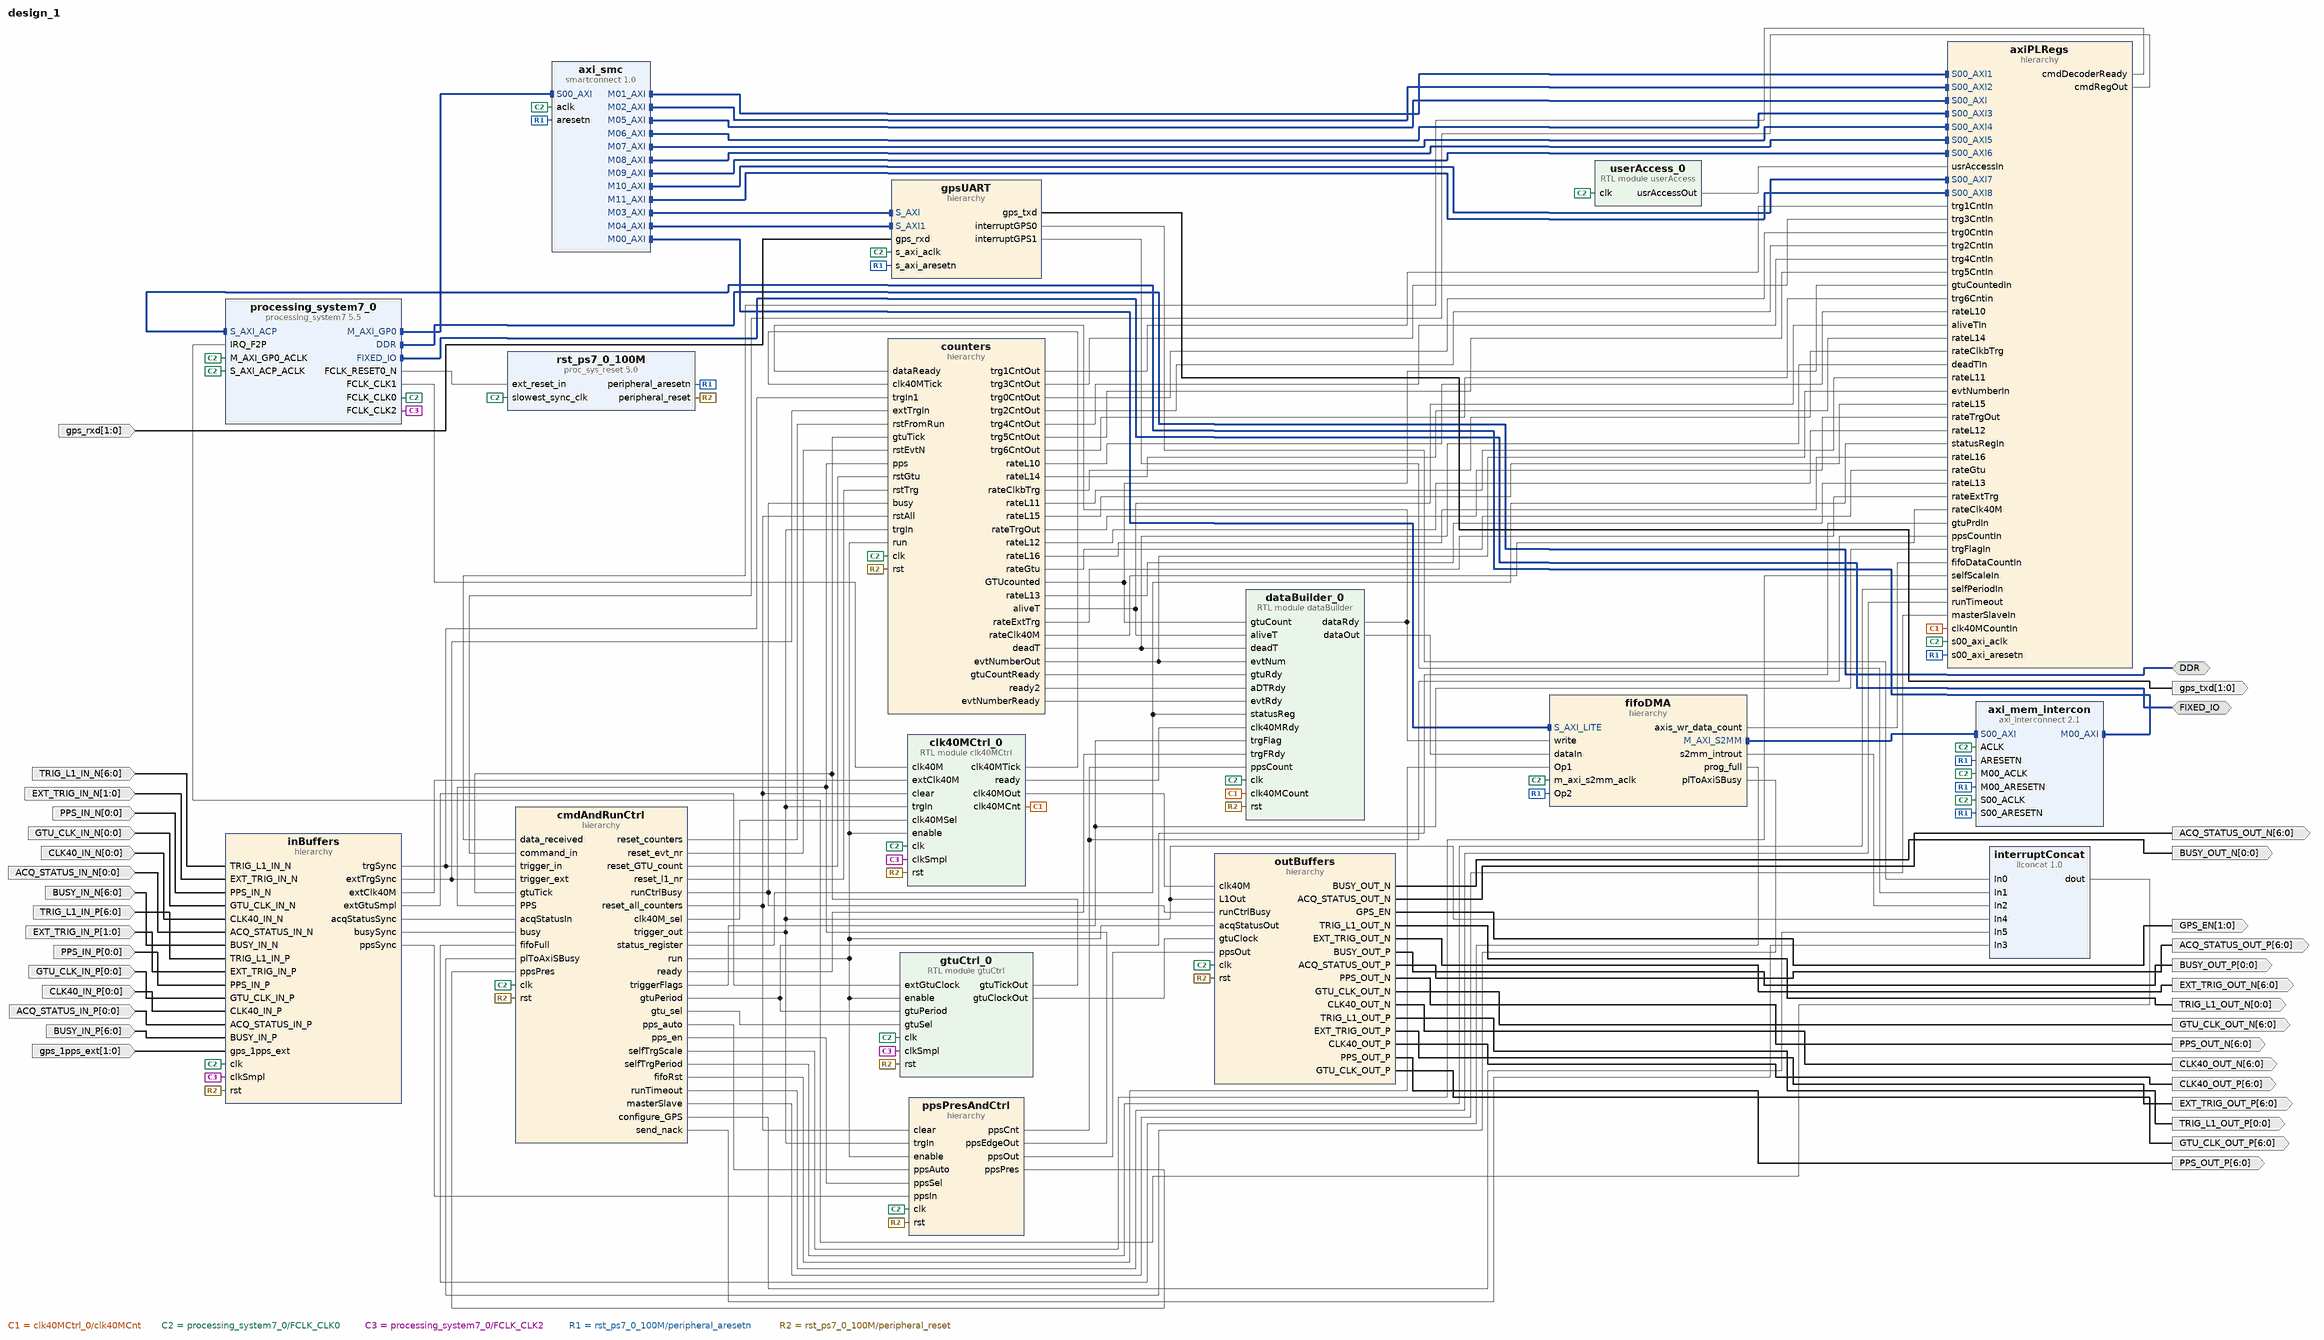
[diagram p0: block diagram of the top level]
# Vivado block design design_1, xc7z020clg484-2, Vivado 2024.2.2
create_bd_design design_1

create_bd_intf_port -mode Master -vlnv xilinx.com:interface:ddrx_rtl:1.0 DDR
create_bd_intf_port -mode Master -vlnv xilinx.com:display_processing_system7:fixedio_rtl:1.0 FIXED_IO
create_bd_port -dir O -from 1 -to 0 GPS_EN
create_bd_port -dir I -from 1 -to 0 gps_1pps_ext
create_bd_port -dir I -from 1 -to 0 gps_rxd
create_bd_port -dir O -from 1 -to 0 gps_txd
create_bd_port -dir I -from 0 -to 0 -type clk PPS_IN_N
create_bd_port -dir I -from 0 -to 0 -type clk PPS_IN_P
create_bd_port -dir O -from 0 -to 0 -type clk BUSY_OUT_N
create_bd_port -dir O -from 0 -to 0 -type clk BUSY_OUT_P
create_bd_port -dir O -from 0 -to 0 -type clk TRIG_L1_OUT_N
create_bd_port -dir O -from 0 -to 0 -type clk TRIG_L1_OUT_P
create_bd_port -dir I -from 1 -to 0 -type clk EXT_TRIG_IN_N
create_bd_port -dir I -from 1 -to 0 -type clk EXT_TRIG_IN_P
create_bd_port -dir I -from 0 -to 0 -type clk GTU_CLK_IN_N
create_bd_port -dir I -from 0 -to 0 -type clk GTU_CLK_IN_P
create_bd_port -dir I -from 0 -to 0 -type clk CLK40_IN_N
create_bd_port -dir I -from 0 -to 0 -type clk CLK40_IN_P
create_bd_port -dir I -from 0 -to 0 -type clk ACQ_STATUS_IN_N
create_bd_port -dir I -from 0 -to 0 -type clk ACQ_STATUS_IN_P
create_bd_port -dir I -from 6 -to 0 -type clk TRIG_L1_IN_N
create_bd_port -dir I -from 6 -to 0 -type clk TRIG_L1_IN_P
create_bd_port -dir I -from 6 -to 0 -type clk BUSY_IN_N
create_bd_port -dir I -from 6 -to 0 -type clk BUSY_IN_P
create_bd_port -dir O -from 6 -to 0 -type clk PPS_OUT_N
create_bd_port -dir O -from 6 -to 0 -type clk PPS_OUT_P
create_bd_port -dir O -from 6 -to 0 -type clk EXT_TRIG_OUT_N
create_bd_port -dir O -from 6 -to 0 -type clk EXT_TRIG_OUT_P
create_bd_port -dir O -from 6 -to 0 -type clk GTU_CLK_OUT_N
create_bd_port -dir O -from 6 -to 0 -type clk GTU_CLK_OUT_P
create_bd_port -dir O -from 6 -to 0 CLK40_OUT_N
create_bd_port -dir O -from 6 -to 0 CLK40_OUT_P
create_bd_port -dir O -from 6 -to 0 -type clk ACQ_STATUS_OUT_N
create_bd_port -dir O -from 6 -to 0 -type clk ACQ_STATUS_OUT_P

create_bd_cell -type ip -vlnv xilinx.com:ip:processing_system7:5.5 processing_system7_0
set_property -dict [list \
  CONFIG.PCW_CAN1_CAN1_IO {MIO 12 .. 13} \
  CONFIG.PCW_CAN1_PERIPHERAL_ENABLE 1 \
  CONFIG.PCW_ENET0_ENET0_IO {MIO 16 .. 27} \
  CONFIG.PCW_ENET0_GRP_MDIO_ENABLE 1 \
  CONFIG.PCW_ENET0_GRP_MDIO_IO {MIO 52 .. 53} \
  CONFIG.PCW_ENET0_PERIPHERAL_ENABLE 1 \
  CONFIG.PCW_ENET_RESET_ENABLE 0 \
  CONFIG.PCW_EN_CLK1_PORT 1 \
  CONFIG.PCW_EN_CLK2_PORT 1 \
  CONFIG.PCW_FCLK_CLK2_BUF TRUE \
  CONFIG.PCW_FPGA0_PERIPHERAL_FREQMHZ 100 \
  CONFIG.PCW_FPGA1_PERIPHERAL_FREQMHZ 40 \
  CONFIG.PCW_FPGA2_PERIPHERAL_FREQMHZ 200 \
  CONFIG.PCW_FPGA_FCLK1_ENABLE 1 \
  CONFIG.PCW_FPGA_FCLK2_ENABLE 1 \
  CONFIG.PCW_GPIO_MIO_GPIO_ENABLE 1 \
  CONFIG.PCW_GPIO_MIO_GPIO_IO MIO \
  CONFIG.PCW_I2C0_GRP_INT_ENABLE 0 \
  CONFIG.PCW_I2C0_I2C0_IO {MIO 10 .. 11} \
  CONFIG.PCW_I2C0_PERIPHERAL_ENABLE 1 \
  CONFIG.PCW_I2C_PERIPHERAL_FREQMHZ 111.111115 \
  CONFIG.PCW_I2C_RESET_ENABLE 0 \
  CONFIG.PCW_IRQ_F2P_INTR 1 \
  CONFIG.PCW_PERIPHERAL_BOARD_PRESET part0 \
  CONFIG.PCW_PRESET_BANK1_VOLTAGE {LVCMOS 1.8V} \
  CONFIG.PCW_QSPI_GRP_FBCLK_ENABLE 1 \
  CONFIG.PCW_QSPI_GRP_FBCLK_IO {MIO 8} \
  CONFIG.PCW_QSPI_GRP_SINGLE_SS_ENABLE 1 \
  CONFIG.PCW_QSPI_GRP_SINGLE_SS_IO {MIO 1 .. 6} \
  CONFIG.PCW_QSPI_PERIPHERAL_ENABLE 1 \
  CONFIG.PCW_QSPI_QSPI_IO {MIO 1 .. 6} \
  CONFIG.PCW_SD0_GRP_CD_ENABLE 0 \
  CONFIG.PCW_SD0_GRP_WP_ENABLE 0 \
  CONFIG.PCW_SD0_PERIPHERAL_ENABLE 1 \
  CONFIG.PCW_SD0_SD0_IO {MIO 40 .. 45} \
  CONFIG.PCW_SD1_PERIPHERAL_ENABLE 1 \
  CONFIG.PCW_SD1_SD1_IO {MIO 46 .. 51} \
  CONFIG.PCW_SDIO_PERIPHERAL_FREQMHZ 100 \
  CONFIG.PCW_SINGLE_QSPI_DATA_MODE x4 \
  CONFIG.PCW_UART0_PERIPHERAL_ENABLE 1 \
  CONFIG.PCW_UART0_UART0_IO {MIO 14 .. 15} \
  CONFIG.PCW_UART1_PERIPHERAL_ENABLE 0 \
  CONFIG.PCW_UART_PERIPHERAL_FREQMHZ 100 \
  CONFIG.PCW_UIPARAM_DDR_PARTNO {MT41J256M16 RE-125} \
  CONFIG.PCW_USB0_PERIPHERAL_ENABLE 0 \
  CONFIG.PCW_USB_RESET_ENABLE 0 \
  CONFIG.PCW_USE_FABRIC_INTERRUPT 1 \
  CONFIG.PCW_USE_S_AXI_ACP 1 \
] [get_bd_cells processing_system7_0]
# 238 more settings of processing_system7_0 are not shown: defaults, MIO pin electricals, DDR timing, and values the tool derives
create_bd_cell -type ip -vlnv xilinx.com:ip:proc_sys_reset:5.0 rst_ps7_0_100M
create_bd_cell -type inline_hdl -vlnv xilinx.com:inline_hdl:ilconcat:1.0 interruptConcat
set_property -dict {CONFIG.NUM_PORTS 6} [get_bd_cells interruptConcat]
create_bd_cell -type module -reference dataBuilder dataBuilder_0
set_property -dict {CONFIG.dataWords 9 CONFIG.statusLen 64 CONFIG.trgNum 9} [get_bd_cells dataBuilder_0]
create_bd_cell -type ip -vlnv xilinx.com:ip:axi_interconnect:2.1 axi_mem_intercon
set_property -dict {CONFIG.NUM_MI 1} [get_bd_cells axi_mem_intercon]
create_bd_cell -type hier cmdAndRunCtrl
create_bd_cell -type hier counters
create_bd_cell -type hier outBuffers
create_bd_cell -type hier fifoDMA
create_bd_cell -type hier gpsUART
create_bd_cell -type hier ppsPresAndCtrl
create_bd_cell -type hier axiPLRegs
create_bd_cell -type hier inBuffers
create_bd_cell -type ip -vlnv xilinx.com:ip:smartconnect:1.0 axi_smc
set_property -dict {CONFIG.NUM_MI 12 CONFIG.NUM_SI 1} [get_bd_cells axi_smc]
create_bd_cell -type module -reference gtuCtrl gtuCtrl_0
create_bd_cell -type module -reference userAccess userAccess_0
create_bd_cell -type module -reference clk40MCtrl clk40MCtrl_0
set_property -dict {CONFIG.trgDelay 3} [get_bd_cells clk40MCtrl_0]

# ---- hierarchy /cmdAndRunCtrl ----
current_bd_instance /cmdAndRunCtrl
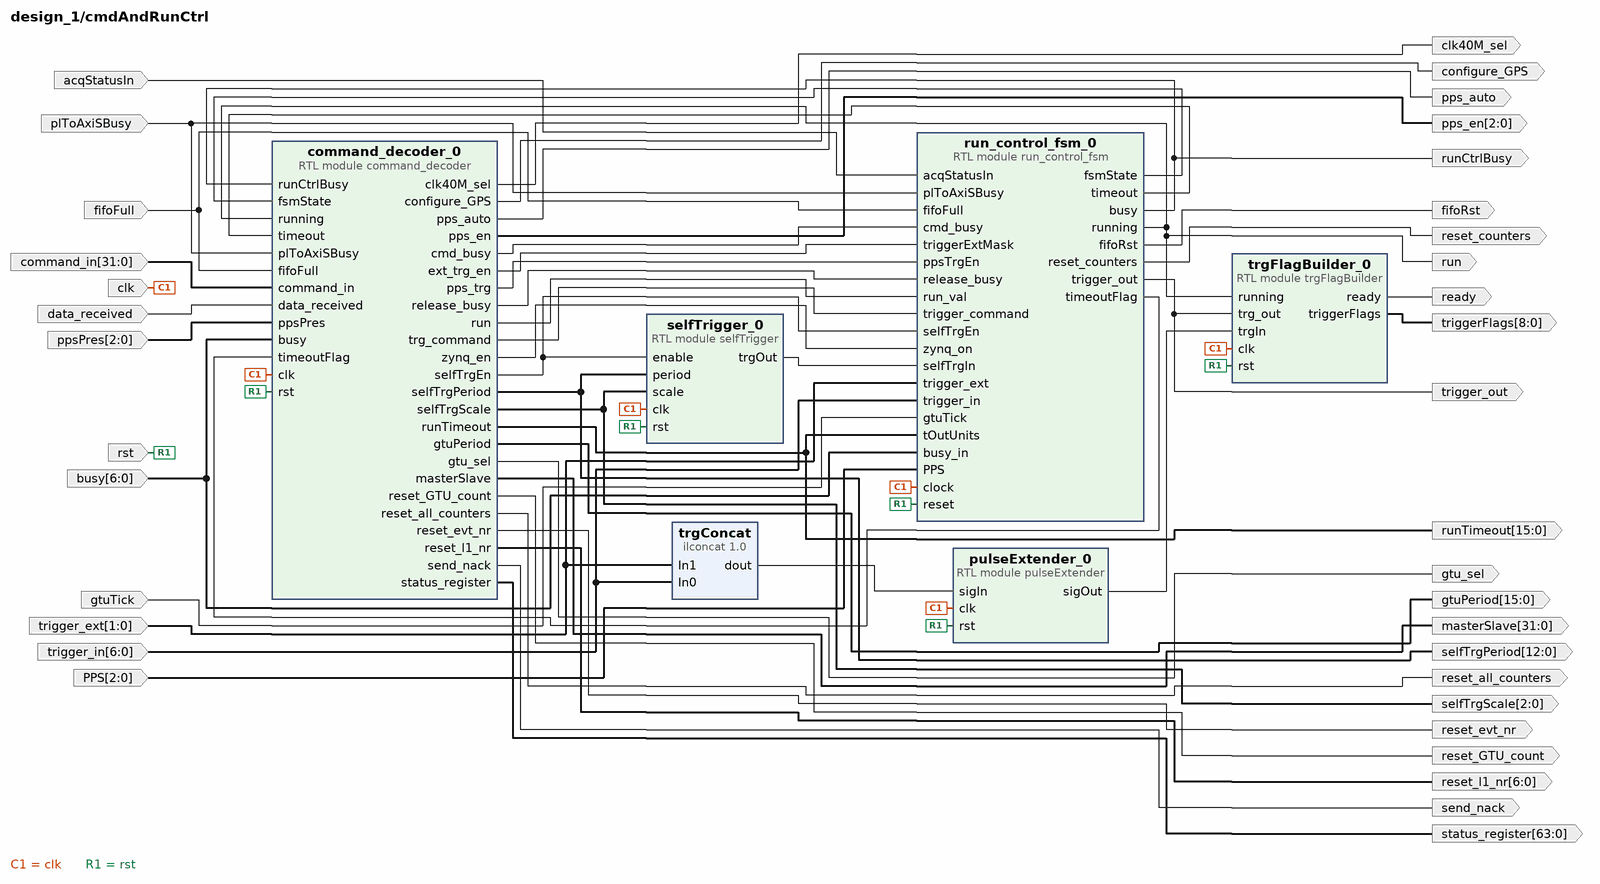
[diagram p1: block diagram inside /cmdAndRunCtrl]
create_bd_pin -dir I -type rst rst
create_bd_pin -dir I -type clk clk
create_bd_pin -dir I gtuTick
create_bd_pin -dir I -from 6 -to 0 trigger_in
create_bd_pin -dir I -from 6 -to 0 busy
create_bd_pin -dir I -from 1 -to 0 trigger_ext
create_bd_pin -dir I -from 2 -to 0 PPS
create_bd_pin -dir I plToAxiSBusy
create_bd_pin -dir I fifoFull
create_bd_pin -dir O trigger_out
create_bd_pin -dir O runCtrlBusy
create_bd_pin -dir O -type rst reset_counters
create_bd_pin -dir O ready
create_bd_pin -dir O -from 8 -to 0 triggerFlags
create_bd_pin -dir O send_nack
create_bd_pin -dir O run
create_bd_pin -dir O -type rst reset_evt_nr
create_bd_pin -dir O -type rst reset_GTU_count
create_bd_pin -dir O -type rst reset_all_counters
create_bd_pin -dir O -from 63 -to 0 status_register
create_bd_pin -dir O -from 2 -to 0 pps_en
create_bd_pin -dir I data_received
create_bd_pin -dir I -from 2 -to 0 ppsPres
create_bd_pin -dir O pps_auto
create_bd_pin -dir I -from 31 -to 0 command_in
create_bd_pin -dir O configure_GPS
create_bd_pin -dir O gtu_sel
create_bd_pin -dir O fifoRst
create_bd_pin -dir O clk40M_sel
create_bd_pin -dir I acqStatusIn
create_bd_pin -dir O -from 6 -to 0 reset_l1_nr
create_bd_pin -dir O -from 15 -to 0 gtuPeriod
create_bd_pin -dir O -from 31 -to 0 masterSlave
create_bd_pin -dir O -from 2 -to 0 selfTrgScale
create_bd_pin -dir O -from 12 -to 0 selfTrgPeriod
create_bd_pin -dir O -from 15 -to 0 runTimeout

create_bd_cell -type module -reference run_control_fsm run_control_fsm_0
set_property -dict [list \
  CONFIG.N_gtu 64 \
  CONFIG.extTrgNum 2 \
  CONFIG.gpsNum 2 \
  CONFIG.nClkRst 32 \
  CONFIG.nClkTick 100000000 \
  CONFIG.zynqNum 7 \
] [get_bd_cells run_control_fsm_0]
create_bd_cell -type module -reference trgFlagBuilder trgFlagBuilder_0
set_property -dict {CONFIG.trgNum 9} [get_bd_cells trgFlagBuilder_0]
create_bd_cell -type module -reference command_decoder command_decoder_0
set_property -dict {CONFIG.extTrgNum 2 CONFIG.ppsNum 3 CONFIG.statusLen 64 CONFIG.zynqNum 7} [get_bd_cells command_decoder_0]
create_bd_cell -type module -reference pulseExtender pulseExtender_0
set_property -dict {CONFIG.sigNum 9 CONFIG.sigWidth 10} [get_bd_cells pulseExtender_0]
create_bd_cell -type inline_hdl -vlnv xilinx.com:inline_hdl:ilconcat:1.0 trgConcat
set_property -dict {CONFIG.NUM_PORTS 2} [get_bd_cells trgConcat]
create_bd_cell -type module -reference selfTrigger selfTrigger_0

# ---- hierarchy /counters ----
current_bd_instance /counters
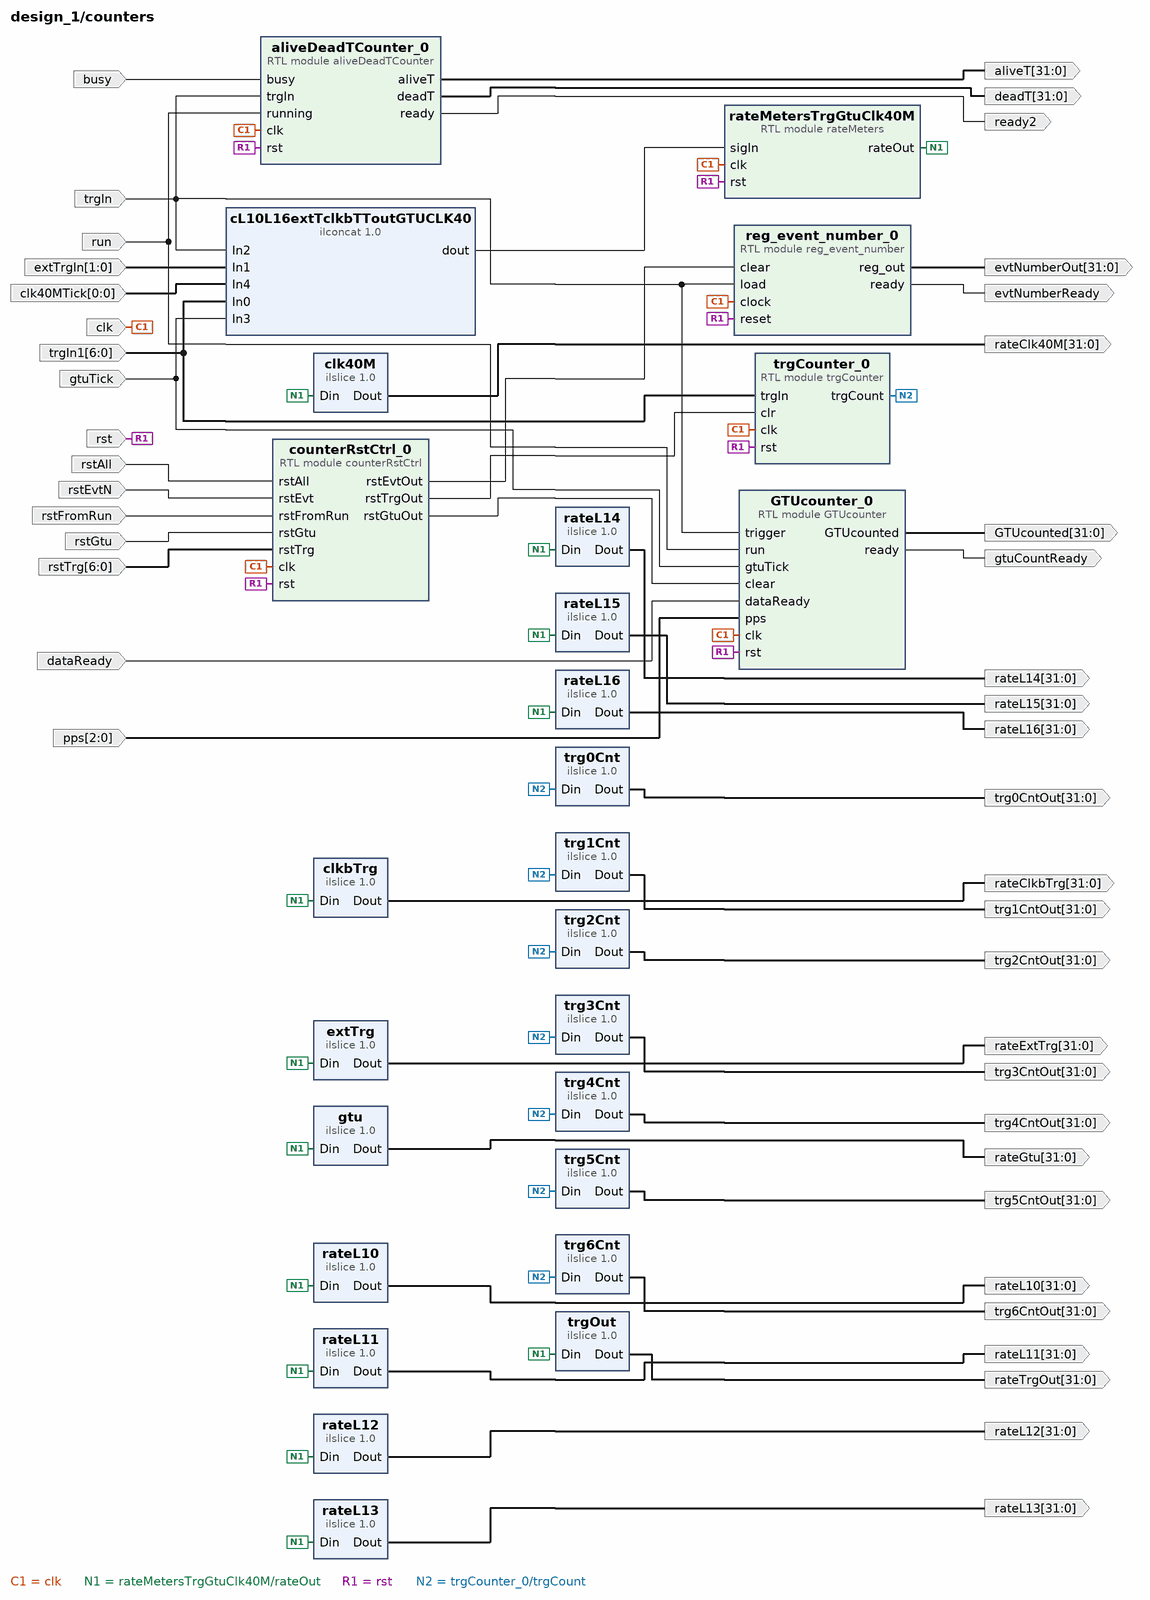
[diagram p2: block diagram inside /counters]
create_bd_pin -dir I -type clk clk
create_bd_pin -dir I -type rst rst
create_bd_pin -dir I trgIn
create_bd_pin -dir O evtNumberReady
create_bd_pin -dir O -from 31 -to 0 evtNumberOut
create_bd_pin -dir I run
create_bd_pin -dir I -from 2 -to 0 pps
create_bd_pin -dir I gtuTick
create_bd_pin -dir O gtuCountReady
create_bd_pin -dir O -from 31 -to 0 GTUcounted
create_bd_pin -dir I busy
create_bd_pin -dir O ready2
create_bd_pin -dir O -from 31 -to 0 aliveT
create_bd_pin -dir O -from 31 -to 0 deadT
create_bd_pin -dir I -from 6 -to 0 trgIn1
create_bd_pin -dir I rstEvtN
create_bd_pin -dir I rstFromRun
create_bd_pin -dir I rstGtu
create_bd_pin -dir I rstAll
create_bd_pin -dir O -from 31 -to 0 trg1CntOut
create_bd_pin -dir O -from 31 -to 0 trg3CntOut
create_bd_pin -dir O -from 31 -to 0 trg0CntOut
create_bd_pin -dir O -from 31 -to 0 trg2CntOut
create_bd_pin -dir I dataReady
create_bd_pin -dir O -from 31 -to 0 trg4CntOut
create_bd_pin -dir O -from 31 -to 0 trg5CntOut
create_bd_pin -dir O -from 31 -to 0 trg6CntOut
create_bd_pin -dir I -from 6 -to 0 rstTrg
create_bd_pin -dir I -from 1 -to 0 extTrgIn
create_bd_pin -dir I -from 0 -to 0 clk40MTick
create_bd_pin -dir O -from 31 -to 0 rateL10
create_bd_pin -dir O -from 31 -to 0 rateL11
create_bd_pin -dir O -from 31 -to 0 rateL12
create_bd_pin -dir O -from 31 -to 0 rateL13
create_bd_pin -dir O -from 31 -to 0 rateL14
create_bd_pin -dir O -from 31 -to 0 rateL15
create_bd_pin -dir O -from 31 -to 0 rateL16
create_bd_pin -dir O -from 31 -to 0 rateExtTrg
create_bd_pin -dir O -from 31 -to 0 rateClkbTrg
create_bd_pin -dir O -from 31 -to 0 rateTrgOut
create_bd_pin -dir O -from 31 -to 0 rateGtu
create_bd_pin -dir O -from 31 -to 0 rateClk40M

create_bd_cell -type module -reference reg_event_number reg_event_number_0
create_bd_cell -type module -reference GTUcounter GTUcounter_0
create_bd_cell -type module -reference aliveDeadTCounter aliveDeadTCounter_0
create_bd_cell -type module -reference trgCounter trgCounter_0
set_property -dict {CONFIG.trgNum 7} [get_bd_cells trgCounter_0]
create_bd_cell -type module -reference counterRstCtrl counterRstCtrl_0
set_property -dict {CONFIG.zynqNum 7} [get_bd_cells counterRstCtrl_0]
create_bd_cell -type inline_hdl -vlnv xilinx.com:inline_hdl:ilslice:1.0 trg1Cnt
set_property -dict {CONFIG.DIN_FROM 63 CONFIG.DIN_TO 32 CONFIG.DIN_WIDTH 224} [get_bd_cells trg1Cnt]
create_bd_cell -type inline_hdl -vlnv xilinx.com:inline_hdl:ilslice:1.0 trg2Cnt
set_property -dict {CONFIG.DIN_FROM 95 CONFIG.DIN_TO 64 CONFIG.DIN_WIDTH 224} [get_bd_cells trg2Cnt]
create_bd_cell -type inline_hdl -vlnv xilinx.com:inline_hdl:ilslice:1.0 trg0Cnt
set_property -dict {CONFIG.DIN_FROM 31 CONFIG.DIN_WIDTH 224} [get_bd_cells trg0Cnt]
create_bd_cell -type inline_hdl -vlnv xilinx.com:inline_hdl:ilslice:1.0 trg3Cnt
set_property -dict {CONFIG.DIN_FROM 127 CONFIG.DIN_TO 96 CONFIG.DIN_WIDTH 224} [get_bd_cells trg3Cnt]
create_bd_cell -type inline_hdl -vlnv xilinx.com:inline_hdl:ilslice:1.0 trg4Cnt
set_property -dict {CONFIG.DIN_FROM 159 CONFIG.DIN_TO 128 CONFIG.DIN_WIDTH 224} [get_bd_cells trg4Cnt]
create_bd_cell -type inline_hdl -vlnv xilinx.com:inline_hdl:ilslice:1.0 trg5Cnt
set_property -dict {CONFIG.DIN_FROM 191 CONFIG.DIN_TO 160 CONFIG.DIN_WIDTH 224} [get_bd_cells trg5Cnt]
create_bd_cell -type inline_hdl -vlnv xilinx.com:inline_hdl:ilslice:1.0 trg6Cnt
set_property -dict {CONFIG.DIN_FROM 223 CONFIG.DIN_TO 192 CONFIG.DIN_WIDTH 224} [get_bd_cells trg6Cnt]
create_bd_cell -type module -reference rateMeters rateMetersTrgGtuClk40M
set_property -dict {CONFIG.clkFreq 100000000 CONFIG.rateLen 32 CONFIG.sigNum 12} [get_bd_cells rateMetersTrgGtuClk40M]
create_bd_cell -type inline_hdl -vlnv xilinx.com:inline_hdl:ilconcat:1.0 cL10L16extTclkbTToutGTUCLK40
set_property -dict {CONFIG.NUM_PORTS 5} [get_bd_cells cL10L16extTclkbTToutGTUCLK40]
create_bd_cell -type inline_hdl -vlnv xilinx.com:inline_hdl:ilslice:1.0 rateL10
set_property -dict {CONFIG.DIN_FROM 31 CONFIG.DIN_WIDTH 384} [get_bd_cells rateL10]
create_bd_cell -type inline_hdl -vlnv xilinx.com:inline_hdl:ilslice:1.0 rateL13
set_property -dict {CONFIG.DIN_FROM 127 CONFIG.DIN_TO 96 CONFIG.DIN_WIDTH 384} [get_bd_cells rateL13]
create_bd_cell -type inline_hdl -vlnv xilinx.com:inline_hdl:ilslice:1.0 rateL14
set_property -dict {CONFIG.DIN_FROM 159 CONFIG.DIN_TO 128 CONFIG.DIN_WIDTH 384} [get_bd_cells rateL14]
create_bd_cell -type inline_hdl -vlnv xilinx.com:inline_hdl:ilslice:1.0 rateL15
set_property -dict {CONFIG.DIN_FROM 191 CONFIG.DIN_TO 160 CONFIG.DIN_WIDTH 384} [get_bd_cells rateL15]
create_bd_cell -type inline_hdl -vlnv xilinx.com:inline_hdl:ilslice:1.0 rateL16
set_property -dict {CONFIG.DIN_FROM 223 CONFIG.DIN_TO 192 CONFIG.DIN_WIDTH 384} [get_bd_cells rateL16]
create_bd_cell -type inline_hdl -vlnv xilinx.com:inline_hdl:ilslice:1.0 clkbTrg
set_property -dict {CONFIG.DIN_FROM 255 CONFIG.DIN_TO 224 CONFIG.DIN_WIDTH 384} [get_bd_cells clkbTrg]
create_bd_cell -type inline_hdl -vlnv xilinx.com:inline_hdl:ilslice:1.0 extTrg
set_property -dict {CONFIG.DIN_FROM 287 CONFIG.DIN_TO 256 CONFIG.DIN_WIDTH 384} [get_bd_cells extTrg]
create_bd_cell -type inline_hdl -vlnv xilinx.com:inline_hdl:ilslice:1.0 trgOut
set_property -dict {CONFIG.DIN_FROM 319 CONFIG.DIN_TO 288 CONFIG.DIN_WIDTH 384} [get_bd_cells trgOut]
create_bd_cell -type inline_hdl -vlnv xilinx.com:inline_hdl:ilslice:1.0 gtu
set_property -dict {CONFIG.DIN_FROM 351 CONFIG.DIN_TO 320 CONFIG.DIN_WIDTH 384 CONFIG.DOUT_WIDTH 32} [get_bd_cells gtu]
create_bd_cell -type inline_hdl -vlnv xilinx.com:inline_hdl:ilslice:1.0 clk40M
set_property -dict {CONFIG.DIN_FROM 383 CONFIG.DIN_TO 352 CONFIG.DIN_WIDTH 384} [get_bd_cells clk40M]
create_bd_cell -type inline_hdl -vlnv xilinx.com:inline_hdl:ilslice:1.0 rateL12
set_property -dict {CONFIG.DIN_FROM 95 CONFIG.DIN_TO 64 CONFIG.DIN_WIDTH 384} [get_bd_cells rateL12]
create_bd_cell -type inline_hdl -vlnv xilinx.com:inline_hdl:ilslice:1.0 rateL11
set_property -dict {CONFIG.DIN_FROM 63 CONFIG.DIN_TO 32 CONFIG.DIN_WIDTH 384} [get_bd_cells rateL11]

# ---- hierarchy /outBuffers ----
current_bd_instance /outBuffers
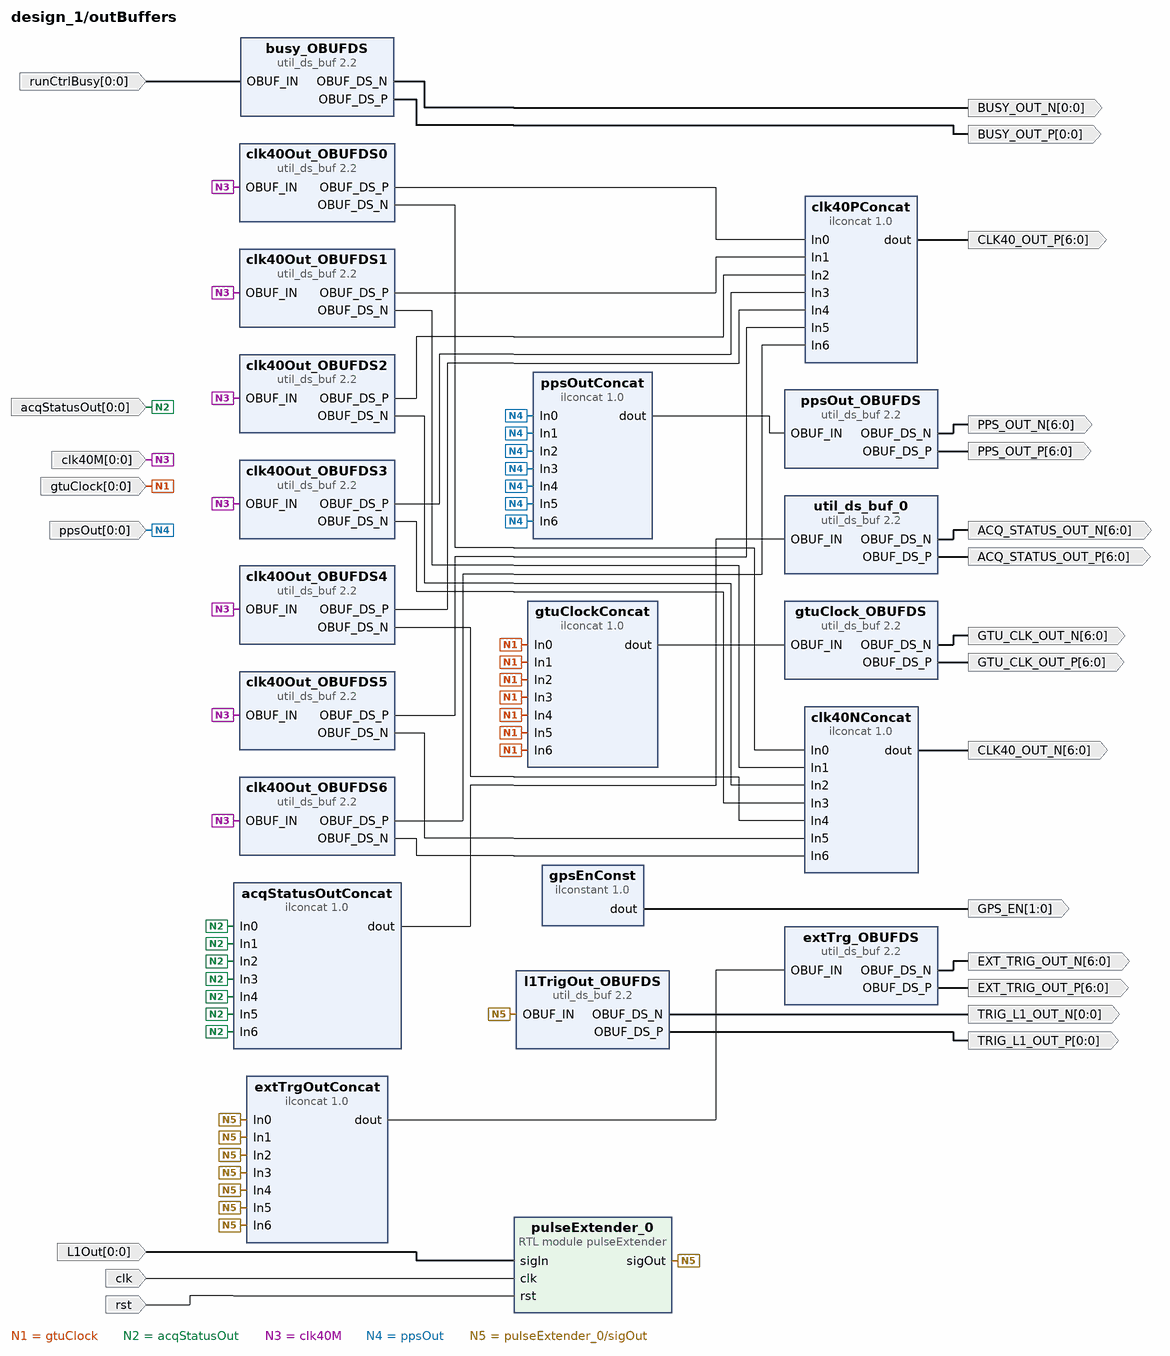
[diagram p3: block diagram inside /outBuffers]
create_bd_pin -dir I -from 0 -to 0 gtuClock
create_bd_pin -dir I -from 0 -to 0 L1Out
create_bd_pin -dir O -from 1 -to 0 GPS_EN
create_bd_pin -dir I -from 0 -to 0 ppsOut
create_bd_pin -dir I -type clk clk
create_bd_pin -dir I -type rst rst
create_bd_pin -dir I -from 0 -to 0 -type clk runCtrlBusy
create_bd_pin -dir O -from 0 -to 0 -type clk BUSY_OUT_N
create_bd_pin -dir O -from 0 -to 0 -type clk BUSY_OUT_P
create_bd_pin -dir O -from 0 -to 0 -type clk TRIG_L1_OUT_N
create_bd_pin -dir O -from 0 -to 0 -type clk TRIG_L1_OUT_P
create_bd_pin -dir I -from 0 -to 0 -type clk clk40M
create_bd_pin -dir I -from 0 -to 0 -type clk acqStatusOut
create_bd_pin -dir O -from 6 -to 0 -type clk PPS_OUT_N
create_bd_pin -dir O -from 6 -to 0 -type clk PPS_OUT_P
create_bd_pin -dir O -from 6 -to 0 -type clk EXT_TRIG_OUT_N
create_bd_pin -dir O -from 6 -to 0 -type clk EXT_TRIG_OUT_P
create_bd_pin -dir O -from 6 -to 0 -type clk GTU_CLK_OUT_N
create_bd_pin -dir O -from 6 -to 0 -type clk GTU_CLK_OUT_P
create_bd_pin -dir O -from 6 -to 0 CLK40_OUT_N
create_bd_pin -dir O -from 6 -to 0 CLK40_OUT_P
create_bd_pin -dir O -from 6 -to 0 -type clk ACQ_STATUS_OUT_N
create_bd_pin -dir O -from 6 -to 0 -type clk ACQ_STATUS_OUT_P

create_bd_cell -type inline_hdl -vlnv xilinx.com:inline_hdl:ilconcat:1.0 gtuClockConcat
set_property -dict {CONFIG.NUM_PORTS 7} [get_bd_cells gtuClockConcat]
create_bd_cell -type ip -vlnv xilinx.com:ip:util_ds_buf:2.2 ppsOut_OBUFDS
set_property -dict {CONFIG.C_BUF_TYPE OBUFDS CONFIG.C_SIZE 7} [get_bd_cells ppsOut_OBUFDS]
create_bd_cell -type ip -vlnv xilinx.com:ip:util_ds_buf:2.2 gtuClock_OBUFDS
set_property -dict {CONFIG.C_BUF_TYPE OBUFDS CONFIG.C_SIZE 7} [get_bd_cells gtuClock_OBUFDS]
create_bd_cell -type inline_hdl -vlnv xilinx.com:inline_hdl:ilconcat:1.0 extTrgOutConcat
set_property -dict {CONFIG.NUM_PORTS 7} [get_bd_cells extTrgOutConcat]
create_bd_cell -type ip -vlnv xilinx.com:ip:util_ds_buf:2.2 clk40Out_OBUFDS0
set_property -dict {CONFIG.C_BUF_TYPE OBUFDS CONFIG.C_SIZE 1} [get_bd_cells clk40Out_OBUFDS0]
create_bd_cell -type ip -vlnv xilinx.com:ip:util_ds_buf:2.2 extTrg_OBUFDS
set_property -dict {CONFIG.C_BUF_TYPE OBUFDS CONFIG.C_SIZE 7} [get_bd_cells extTrg_OBUFDS]
create_bd_cell -type inline_hdl -vlnv xilinx.com:inline_hdl:ilconstant:1.0 gpsEnConst
set_property -dict {CONFIG.CONST_VAL 0b11 CONFIG.CONST_WIDTH 2} [get_bd_cells gpsEnConst]
create_bd_cell -type inline_hdl -vlnv xilinx.com:inline_hdl:ilconcat:1.0 ppsOutConcat
set_property -dict {CONFIG.NUM_PORTS 7} [get_bd_cells ppsOutConcat]
create_bd_cell -type module -reference pulseExtender pulseExtender_0
set_property -dict {CONFIG.sigNum 1 CONFIG.sigWidth 10} [get_bd_cells pulseExtender_0]
create_bd_cell -type ip -vlnv xilinx.com:ip:util_ds_buf:2.2 busy_OBUFDS
set_property -dict {CONFIG.C_BUF_TYPE OBUFDS} [get_bd_cells busy_OBUFDS]
create_bd_cell -type ip -vlnv xilinx.com:ip:util_ds_buf:2.2 l1TrigOut_OBUFDS
set_property -dict {CONFIG.C_BUF_TYPE OBUFDS} [get_bd_cells l1TrigOut_OBUFDS]
create_bd_cell -type ip -vlnv xilinx.com:ip:util_ds_buf:2.2 clk40Out_OBUFDS1
set_property -dict {CONFIG.C_BUF_TYPE OBUFDS} [get_bd_cells clk40Out_OBUFDS1]
create_bd_cell -type ip -vlnv xilinx.com:ip:util_ds_buf:2.2 clk40Out_OBUFDS2
set_property -dict {CONFIG.C_BUF_TYPE OBUFDS} [get_bd_cells clk40Out_OBUFDS2]
create_bd_cell -type ip -vlnv xilinx.com:ip:util_ds_buf:2.2 clk40Out_OBUFDS3
set_property -dict {CONFIG.C_BUF_TYPE OBUFDS} [get_bd_cells clk40Out_OBUFDS3]
create_bd_cell -type inline_hdl -vlnv xilinx.com:inline_hdl:ilconcat:1.0 clk40NConcat
set_property -dict {CONFIG.NUM_PORTS 7} [get_bd_cells clk40NConcat]
create_bd_cell -type inline_hdl -vlnv xilinx.com:inline_hdl:ilconcat:1.0 clk40PConcat
set_property -dict {CONFIG.NUM_PORTS 7} [get_bd_cells clk40PConcat]
create_bd_cell -type ip -vlnv xilinx.com:ip:util_ds_buf:2.2 util_ds_buf_0
set_property -dict {CONFIG.C_BUF_TYPE OBUFDS CONFIG.C_SIZE 7} [get_bd_cells util_ds_buf_0]
create_bd_cell -type inline_hdl -vlnv xilinx.com:inline_hdl:ilconcat:1.0 acqStatusOutConcat
set_property -dict {CONFIG.NUM_PORTS 7} [get_bd_cells acqStatusOutConcat]
create_bd_cell -type ip -vlnv xilinx.com:ip:util_ds_buf:2.2 clk40Out_OBUFDS4
set_property -dict {CONFIG.C_BUF_TYPE OBUFDS} [get_bd_cells clk40Out_OBUFDS4]
create_bd_cell -type ip -vlnv xilinx.com:ip:util_ds_buf:2.2 clk40Out_OBUFDS5
set_property -dict {CONFIG.C_BUF_TYPE OBUFDS} [get_bd_cells clk40Out_OBUFDS5]
create_bd_cell -type ip -vlnv xilinx.com:ip:util_ds_buf:2.2 clk40Out_OBUFDS6
set_property -dict {CONFIG.C_BUF_TYPE OBUFDS} [get_bd_cells clk40Out_OBUFDS6]

# ---- hierarchy /fifoDMA ----
current_bd_instance /fifoDMA
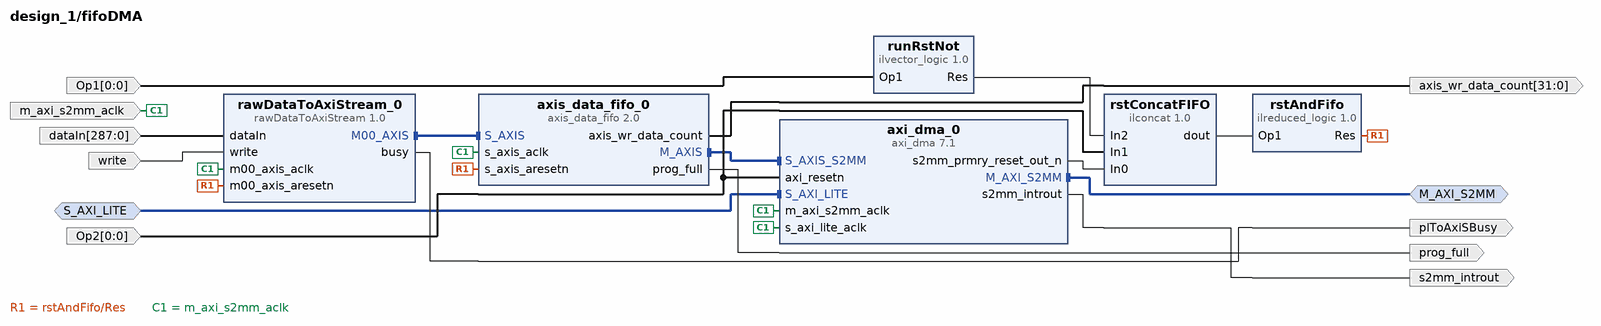
[diagram p4: block diagram inside /fifoDMA]
create_bd_intf_pin -mode Slave -vlnv xilinx.com:interface:aximm_rtl:1.0 S_AXI_LITE
create_bd_intf_pin -mode Master -vlnv xilinx.com:interface:aximm_rtl:1.0 M_AXI_S2MM
create_bd_pin -dir I -type clk m_axi_s2mm_aclk
create_bd_pin -dir I -from 0 -to 0 Op2
create_bd_pin -dir O -type intr s2mm_introut
create_bd_pin -dir O prog_full
create_bd_pin -dir O -from 31 -to 0 axis_wr_data_count
create_bd_pin -dir O plToAxiSBusy
create_bd_pin -dir I -from 287 -to 0 dataIn
create_bd_pin -dir I write
create_bd_pin -dir I -from 0 -to 0 Op1

create_bd_cell -type ip -vlnv xilinx.com:ip:axi_dma:7.1 axi_dma_0
set_property -dict {CONFIG.c_include_mm2s 0 CONFIG.c_include_sg 0} [get_bd_cells axi_dma_0]
create_bd_cell -type ip -vlnv xilinx.com:ip:axis_data_fifo:2.0 axis_data_fifo_0
set_property -dict [list \
  CONFIG.FIFO_DEPTH 4096 \
  CONFIG.FIFO_MEMORY_TYPE block \
  CONFIG.FIFO_MODE 2 \
  CONFIG.HAS_PROG_FULL 1 \
  CONFIG.HAS_WR_DATA_COUNT 1 \
  CONFIG.PROG_FULL_THRESH 2043 \
] [get_bd_cells axis_data_fifo_0]
create_bd_cell -type ip -vlnv mames:user:rawDataToAxiStream:1.0 rawDataToAxiStream_0
set_property -dict {CONFIG.C_M00_AXIS_START_COUNT 1 CONFIG.rawDataSize 288} [get_bd_cells rawDataToAxiStream_0]
create_bd_cell -type inline_hdl -vlnv xilinx.com:inline_hdl:ilreduced_logic:1.0 rstAndFifo
set_property -dict {CONFIG.C_SIZE 3} [get_bd_cells rstAndFifo]
create_bd_cell -type inline_hdl -vlnv xilinx.com:inline_hdl:ilconcat:1.0 rstConcatFIFO
set_property -dict {CONFIG.NUM_PORTS 3} [get_bd_cells rstConcatFIFO]
create_bd_cell -type inline_hdl -vlnv xilinx.com:inline_hdl:ilvector_logic:1.0 runRstNot
set_property -dict {CONFIG.C_OPERATION not CONFIG.C_SIZE 1} [get_bd_cells runRstNot]

# ---- hierarchy /gpsUART ----
current_bd_instance /gpsUART
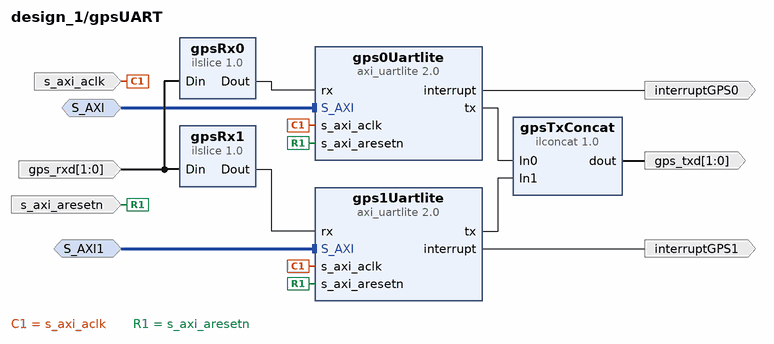
[diagram p5: block diagram inside /gpsUART]
create_bd_intf_pin -mode Slave -vlnv xilinx.com:interface:aximm_rtl:1.0 S_AXI
create_bd_intf_pin -mode Slave -vlnv xilinx.com:interface:aximm_rtl:1.0 S_AXI1
create_bd_pin -dir I -type clk s_axi_aclk
create_bd_pin -dir I -type rst s_axi_aresetn
create_bd_pin -dir O -type intr interruptGPS1
create_bd_pin -dir O -type intr interruptGPS0
create_bd_pin -dir I -from 1 -to 0 gps_rxd
create_bd_pin -dir O -from 1 -to 0 gps_txd

create_bd_cell -type ip -vlnv xilinx.com:ip:axi_uartlite:2.0 gps1Uartlite
set_property -dict {CONFIG.C_BAUDRATE 115200} [get_bd_cells gps1Uartlite]
create_bd_cell -type ip -vlnv xilinx.com:ip:axi_uartlite:2.0 gps0Uartlite
set_property -dict {CONFIG.C_BAUDRATE 115200} [get_bd_cells gps0Uartlite]
create_bd_cell -type inline_hdl -vlnv xilinx.com:inline_hdl:ilslice:1.0 gpsRx1
set_property -dict {CONFIG.DIN_FROM 1 CONFIG.DIN_TO 1 CONFIG.DIN_WIDTH 2} [get_bd_cells gpsRx1]
create_bd_cell -type inline_hdl -vlnv xilinx.com:inline_hdl:ilslice:1.0 gpsRx0
set_property -dict {CONFIG.DIN_WIDTH 2} [get_bd_cells gpsRx0]
create_bd_cell -type inline_hdl -vlnv xilinx.com:inline_hdl:ilconcat:1.0 gpsTxConcat

# ---- hierarchy /ppsPresAndCtrl ----
current_bd_instance /ppsPresAndCtrl
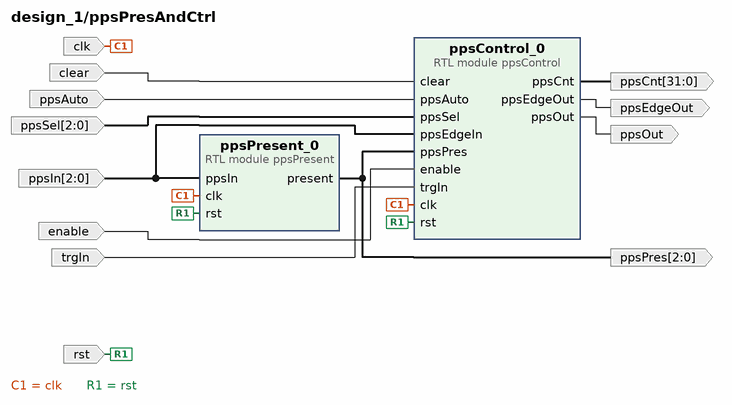
[diagram p6: block diagram inside /ppsPresAndCtrl]
create_bd_pin -dir I -type clk clk
create_bd_pin -dir I -type rst rst
create_bd_pin -dir I -from 2 -to 0 ppsIn
create_bd_pin -dir O -from 2 -to 0 ppsPres
create_bd_pin -dir I ppsAuto
create_bd_pin -dir I -from 2 -to 0 ppsSel
create_bd_pin -dir O ppsOut
create_bd_pin -dir I clear
create_bd_pin -dir O -from 31 -to 0 ppsCnt
create_bd_pin -dir O ppsEdgeOut
create_bd_pin -dir I enable
create_bd_pin -dir I trgIn

create_bd_cell -type module -reference ppsPresent ppsPresent_0
set_property -dict {CONFIG.ppsNum 3 CONFIG.ppsRstVal 1 CONFIG.presWindow 150000000} [get_bd_cells ppsPresent_0]
create_bd_cell -type module -reference ppsControl ppsControl_0
set_property -dict {CONFIG.clkFreq 100000000 CONFIG.ppsNum 3 CONFIG.ppsWidth 10} [get_bd_cells ppsControl_0]

# ---- hierarchy /axiPLRegs ----
current_bd_instance /axiPLRegs
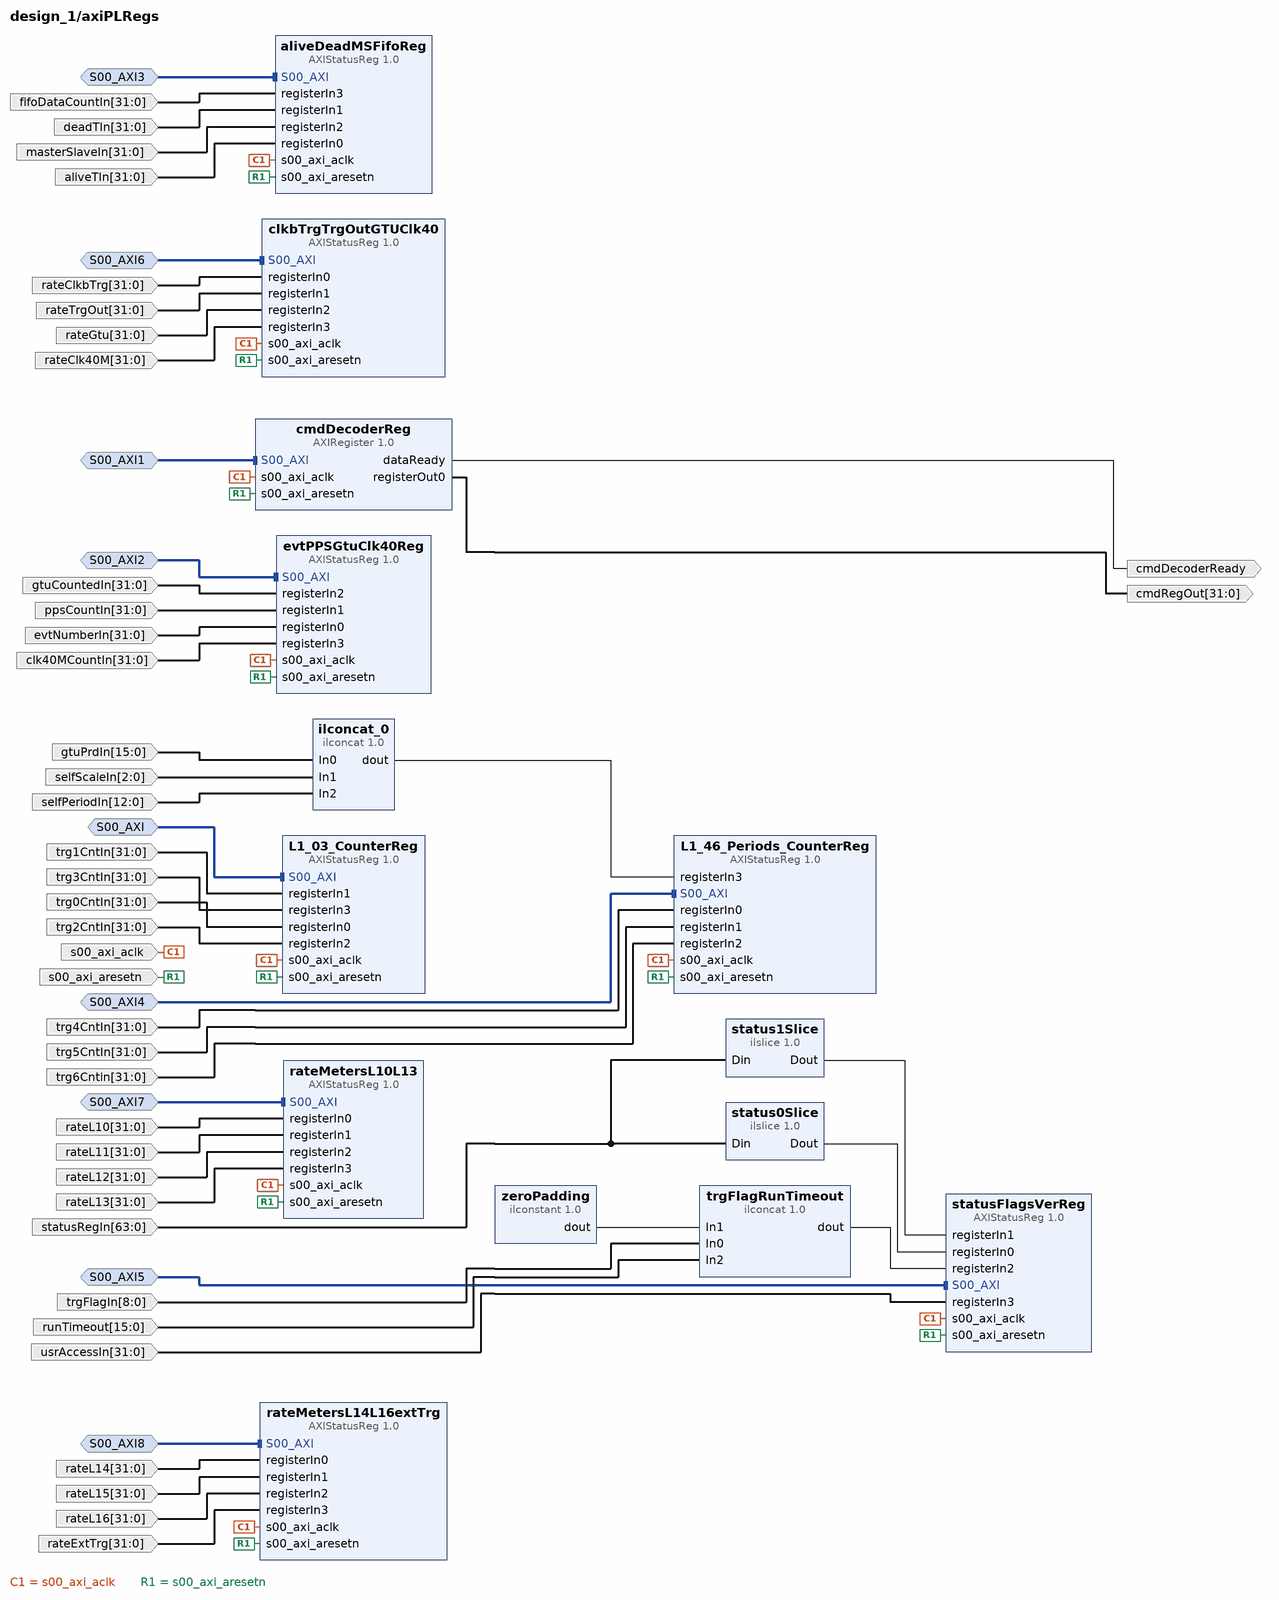
[diagram p7: block diagram inside /axiPLRegs]
create_bd_intf_pin -mode Slave -vlnv xilinx.com:interface:aximm_rtl:1.0 S00_AXI
create_bd_intf_pin -mode Slave -vlnv xilinx.com:interface:aximm_rtl:1.0 S00_AXI1
create_bd_intf_pin -mode Slave -vlnv xilinx.com:interface:aximm_rtl:1.0 S00_AXI2
create_bd_intf_pin -mode Slave -vlnv xilinx.com:interface:aximm_rtl:1.0 S00_AXI3
create_bd_intf_pin -mode Slave -vlnv xilinx.com:interface:aximm_rtl:1.0 S00_AXI4
create_bd_intf_pin -mode Slave -vlnv xilinx.com:interface:aximm_rtl:1.0 S00_AXI5
create_bd_intf_pin -mode Slave -vlnv xilinx.com:interface:aximm_rtl:1.0 S00_AXI6
create_bd_intf_pin -mode Slave -vlnv xilinx.com:interface:aximm_rtl:1.0 S00_AXI7
create_bd_intf_pin -mode Slave -vlnv xilinx.com:interface:aximm_rtl:1.0 S00_AXI8
create_bd_pin -dir I -from 31 -to 0 trg0CntIn
create_bd_pin -dir I -from 31 -to 0 trg1CntIn
create_bd_pin -dir I -from 31 -to 0 trg2CntIn
create_bd_pin -dir I -from 31 -to 0 trg3CntIn
create_bd_pin -dir I -type clk s00_axi_aclk
create_bd_pin -dir I -type rst s00_axi_aresetn
create_bd_pin -dir O -from 31 -to 0 cmdRegOut
create_bd_pin -dir O cmdDecoderReady
create_bd_pin -dir I -from 63 -to 0 statusRegIn
create_bd_pin -dir I -from 31 -to 0 evtNumberIn
create_bd_pin -dir I -from 31 -to 0 gtuCountedIn
create_bd_pin -dir I -from 31 -to 0 fifoDataCountIn
create_bd_pin -dir I -from 31 -to 0 ppsCountIn
create_bd_pin -dir I -from 31 -to 0 aliveTIn
create_bd_pin -dir I -from 31 -to 0 deadTIn
create_bd_pin -dir I -from 8 -to 0 trgFlagIn
create_bd_pin -dir I -from 31 -to 0 clk40MCountIn
create_bd_pin -dir I -from 31 -to 0 trg4CntIn
create_bd_pin -dir I -from 31 -to 0 trg5CntIn
create_bd_pin -dir I -from 31 -to 0 trg6Cntin
create_bd_pin -dir I -from 31 -to 0 usrAccessIn
create_bd_pin -dir I -from 31 -to 0 masterSlaveIn
create_bd_pin -dir I -from 15 -to 0 gtuPrdIn
create_bd_pin -dir I -from 2 -to 0 selfScaleIn
create_bd_pin -dir I -from 12 -to 0 selfPeriodIn
create_bd_pin -dir I -from 31 -to 0 rateL10
create_bd_pin -dir I -from 31 -to 0 rateL11
create_bd_pin -dir I -from 31 -to 0 rateL12
create_bd_pin -dir I -from 31 -to 0 rateL13
create_bd_pin -dir I -from 31 -to 0 rateL14
create_bd_pin -dir I -from 31 -to 0 rateL15
create_bd_pin -dir I -from 31 -to 0 rateL16
create_bd_pin -dir I -from 31 -to 0 rateExtTrg
create_bd_pin -dir I -from 31 -to 0 rateClkbTrg
create_bd_pin -dir I -from 31 -to 0 rateTrgOut
create_bd_pin -dir I -from 31 -to 0 rateGtu
create_bd_pin -dir I -from 31 -to 0 rateClk40M
create_bd_pin -dir I -from 15 -to 0 runTimeout

create_bd_cell -type ip -vlnv mames:user:AXIStatusReg:1.0 L1_03_CounterReg
create_bd_cell -type ip -vlnv mames:user:AXIRegister:1.0 cmdDecoderReg
create_bd_cell -type ip -vlnv mames:user:AXIStatusReg:1.0 evtPPSGtuClk40Reg
create_bd_cell -type ip -vlnv mames:user:AXIStatusReg:1.0 aliveDeadMSFifoReg
create_bd_cell -type inline_hdl -vlnv xilinx.com:inline_hdl:ilconcat:1.0 trgFlagRunTimeout
set_property -dict {CONFIG.NUM_PORTS 3} [get_bd_cells trgFlagRunTimeout]
create_bd_cell -type inline_hdl -vlnv xilinx.com:inline_hdl:ilconstant:1.0 zeroPadding
set_property -dict {CONFIG.CONST_VAL 0 CONFIG.CONST_WIDTH 7} [get_bd_cells zeroPadding]
create_bd_cell -type ip -vlnv mames:user:AXIStatusReg:1.0 L1_46_Periods_CounterReg
create_bd_cell -type ip -vlnv mames:user:AXIStatusReg:1.0 statusFlagsVerReg
create_bd_cell -type inline_hdl -vlnv xilinx.com:inline_hdl:ilslice:1.0 status0Slice
set_property -dict {CONFIG.DIN_FROM 31 CONFIG.DIN_WIDTH 64} [get_bd_cells status0Slice]
create_bd_cell -type inline_hdl -vlnv xilinx.com:inline_hdl:ilslice:1.0 status1Slice
set_property -dict {CONFIG.DIN_FROM 63 CONFIG.DIN_TO 32 CONFIG.DIN_WIDTH 64} [get_bd_cells status1Slice]
create_bd_cell -type inline_hdl -vlnv xilinx.com:inline_hdl:ilconcat:1.0 ilconcat_0
set_property -dict {CONFIG.NUM_PORTS 3} [get_bd_cells ilconcat_0]
create_bd_cell -type ip -vlnv mames:user:AXIStatusReg:1.0 clkbTrgTrgOutGTUClk40
create_bd_cell -type ip -vlnv mames:user:AXIStatusReg:1.0 rateMetersL14L16extTrg
create_bd_cell -type ip -vlnv mames:user:AXIStatusReg:1.0 rateMetersL10L13

# ---- hierarchy /inBuffers ----
current_bd_instance /inBuffers
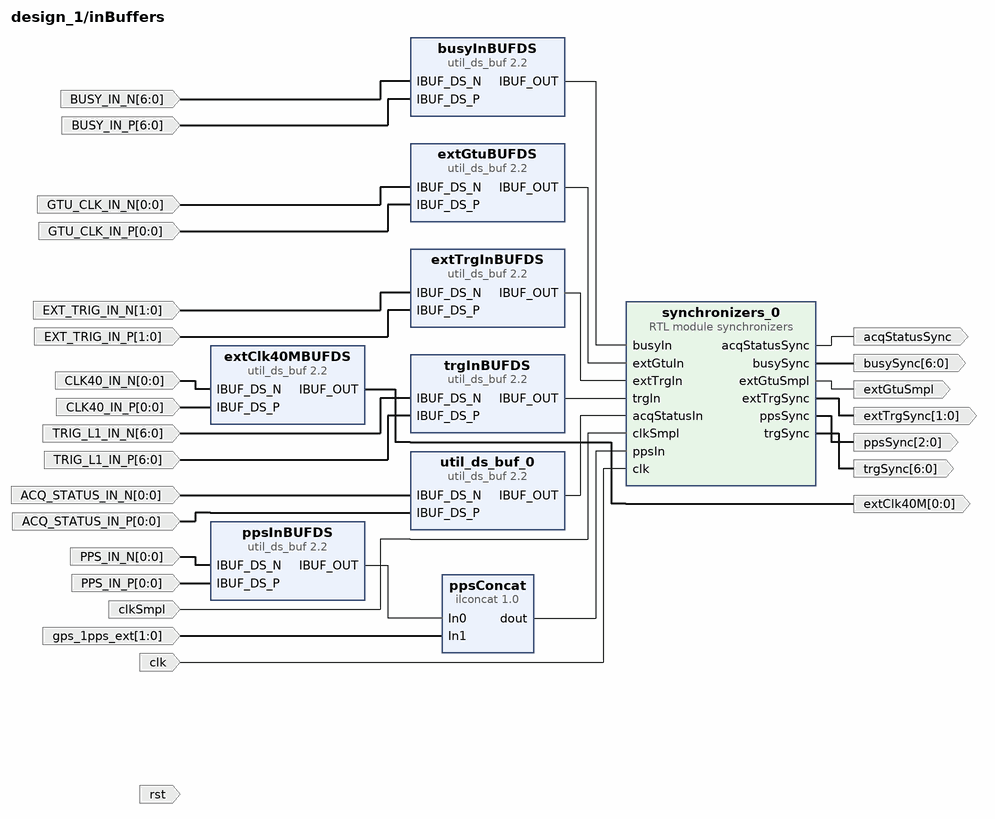
[diagram p8: block diagram inside /inBuffers]
create_bd_pin -dir O -from 6 -to 0 busySync
create_bd_pin -dir O -from 6 -to 0 trgSync
create_bd_pin -dir O -from 1 -to 0 extTrgSync
create_bd_pin -dir I -type clk clk
create_bd_pin -dir O -from 2 -to 0 ppsSync
create_bd_pin -dir I -type rst rst
create_bd_pin -dir I -from 1 -to 0 gps_1pps_ext
create_bd_pin -dir I -from 0 -to 0 -type clk PPS_IN_N
create_bd_pin -dir I -from 0 -to 0 -type clk PPS_IN_P
create_bd_pin -dir I -from 1 -to 0 -type clk EXT_TRIG_IN_N
create_bd_pin -dir I -from 1 -to 0 -type clk EXT_TRIG_IN_P
create_bd_pin -dir O extGtuSmpl
create_bd_pin -dir I -from 0 -to 0 -type clk GTU_CLK_IN_N
create_bd_pin -dir I -from 0 -to 0 -type clk GTU_CLK_IN_P
create_bd_pin -dir I clkSmpl
create_bd_pin -dir I -from 0 -to 0 -type clk CLK40_IN_N
create_bd_pin -dir I -from 0 -to 0 -type clk CLK40_IN_P
create_bd_pin -dir O -from 0 -to 0 -type clk extClk40M
create_bd_pin -dir I -from 0 -to 0 -type clk ACQ_STATUS_IN_N
create_bd_pin -dir I -from 0 -to 0 -type clk ACQ_STATUS_IN_P
create_bd_pin -dir O acqStatusSync
create_bd_pin -dir I -from 6 -to 0 -type clk TRIG_L1_IN_N
create_bd_pin -dir I -from 6 -to 0 -type clk TRIG_L1_IN_P
create_bd_pin -dir I -from 6 -to 0 -type clk BUSY_IN_N
create_bd_pin -dir I -from 6 -to 0 -type clk BUSY_IN_P

create_bd_cell -type ip -vlnv xilinx.com:ip:util_ds_buf:2.2 busyInBUFDS
set_property -dict {CONFIG.C_SIZE 7} [get_bd_cells busyInBUFDS]
create_bd_cell -type ip -vlnv xilinx.com:ip:util_ds_buf:2.2 trgInBUFDS
set_property -dict {CONFIG.C_SIZE 7} [get_bd_cells trgInBUFDS]
create_bd_cell -type ip -vlnv xilinx.com:ip:util_ds_buf:2.2 extTrgInBUFDS
set_property -dict {CONFIG.C_SIZE 2} [get_bd_cells extTrgInBUFDS]
create_bd_cell -type module -reference synchronizers synchronizers_0
set_property -dict {CONFIG.extTrgNum 2 CONFIG.ppsNum 3 CONFIG.zynqNum 7} [get_bd_cells synchronizers_0]
create_bd_cell -type inline_hdl -vlnv xilinx.com:inline_hdl:ilconcat:1.0 ppsConcat
set_property -dict {CONFIG.NUM_PORTS 2} [get_bd_cells ppsConcat]
create_bd_cell -type ip -vlnv xilinx.com:ip:util_ds_buf:2.2 ppsInBUFDS
create_bd_cell -type ip -vlnv xilinx.com:ip:util_ds_buf:2.2 extGtuBUFDS
create_bd_cell -type ip -vlnv xilinx.com:ip:util_ds_buf:2.2 extClk40MBUFDS
create_bd_cell -type ip -vlnv xilinx.com:ip:util_ds_buf:2.2 util_ds_buf_0

# ---- connections ----

current_bd_instance /cmdAndRunCtrl
connect_bd_net [get_bd_pins plToAxiSBusy] [get_bd_pins command_decoder_0/plToAxiSBusy] [get_bd_pins run_control_fsm_0/plToAxiSBusy]
connect_bd_net [get_bd_pins acqStatusIn] [get_bd_pins run_control_fsm_0/acqStatusIn]
connect_bd_net -net axis_data_fifo_0_prog_full [get_bd_pins fifoFull] \
  [get_bd_pins command_decoder_0/fifoFull] [get_bd_pins run_control_fsm_0/fifoFull]
connect_bd_net [get_bd_pins command_decoder_0/clk40M_sel] [get_bd_pins clk40M_sel]
connect_bd_net [get_bd_pins command_decoder_0/cmd_busy] [get_bd_pins run_control_fsm_0/cmd_busy]
connect_bd_net [get_bd_pins command_decoder_0/configure_GPS] [get_bd_pins configure_GPS]
connect_bd_net [get_bd_pins command_decoder_0/ext_trg_en] [get_bd_pins run_control_fsm_0/triggerExtMask]
connect_bd_net -net command_decoder_0_gps_auto [get_bd_pins command_decoder_0/pps_auto] [get_bd_pins pps_auto]
connect_bd_net -net command_decoder_0_gps_en [get_bd_pins command_decoder_0/pps_en] [get_bd_pins pps_en]
connect_bd_net [get_bd_pins command_decoder_0/gtuPeriod] [get_bd_pins gtuPeriod]
connect_bd_net [get_bd_pins command_decoder_0/gtu_sel] [get_bd_pins gtu_sel]
connect_bd_net [get_bd_pins command_decoder_0/masterSlave] [get_bd_pins masterSlave]
connect_bd_net [get_bd_pins command_decoder_0/pps_trg] [get_bd_pins run_control_fsm_0/ppsTrgEn]
connect_bd_net [get_bd_pins command_decoder_0/release_busy] [get_bd_pins run_control_fsm_0/release_busy]
connect_bd_net [get_bd_pins command_decoder_0/reset_GTU_count] [get_bd_pins reset_GTU_count]
connect_bd_net [get_bd_pins command_decoder_0/reset_all_counters] [get_bd_pins reset_all_counters]
connect_bd_net [get_bd_pins command_decoder_0/reset_evt_nr] [get_bd_pins reset_evt_nr]
connect_bd_net [get_bd_pins command_decoder_0/reset_l1_nr] [get_bd_pins reset_l1_nr]
connect_bd_net [get_bd_pins command_decoder_0/run] [get_bd_pins run_control_fsm_0/run_val]
connect_bd_net [get_bd_pins command_decoder_0/runTimeout] [get_bd_pins runTimeout] [get_bd_pins run_control_fsm_0/tOutUnits]
connect_bd_net [get_bd_pins command_decoder_0/selfTrgEn] [get_bd_pins selfTrigger_0/enable] [get_bd_pins run_control_fsm_0/selfTrgEn]
connect_bd_net [get_bd_pins command_decoder_0/selfTrgPeriod] [get_bd_pins selfTrigger_0/period] [get_bd_pins selfTrgPeriod]
connect_bd_net [get_bd_pins command_decoder_0/selfTrgScale] [get_bd_pins selfTrigger_0/scale] [get_bd_pins selfTrgScale]
connect_bd_net [get_bd_pins command_decoder_0/send_nack] [get_bd_pins send_nack]
connect_bd_net [get_bd_pins command_decoder_0/status_register] [get_bd_pins status_register]
connect_bd_net [get_bd_pins command_decoder_0/trg_command] [get_bd_pins run_control_fsm_0/trigger_command]
connect_bd_net [get_bd_pins command_decoder_0/zynq_en] [get_bd_pins run_control_fsm_0/zynq_on]
connect_bd_net [get_bd_pins command_in] [get_bd_pins command_decoder_0/command_in]
connect_bd_net [get_bd_pins data_received] [get_bd_pins command_decoder_0/data_received]
connect_bd_net -net gpsPres_1 [get_bd_pins ppsPres] [get_bd_pins command_decoder_0/ppsPres]
connect_bd_net -net gtuGenerator_0_gtuTick [get_bd_pins gtuTick] [get_bd_pins run_control_fsm_0/gtuTick]
connect_bd_net -net ppsCtrl_0_ppsOut [get_bd_pins PPS] [get_bd_pins run_control_fsm_0/PPS]
connect_bd_net -net processing_system7_0_FCLK_CLK0 [get_bd_pins clk] \
  [get_bd_pins pulseExtender_0/clk] [get_bd_pins trgFlagBuilder_0/clk] [get_bd_pins selfTrigger_0/clk] \
  [get_bd_pins command_decoder_0/clk] [get_bd_pins run_control_fsm_0/clock]
connect_bd_net [get_bd_pins pulseExtender_0/sigOut] [get_bd_pins trgFlagBuilder_0/trgIn]
connect_bd_net -net rst_ps7_0_100M_peripheral_reset [get_bd_pins rst] \
  [get_bd_pins pulseExtender_0/rst] [get_bd_pins trgFlagBuilder_0/rst] [get_bd_pins selfTrigger_0/rst] \
  [get_bd_pins command_decoder_0/rst] [get_bd_pins run_control_fsm_0/reset]
connect_bd_net [get_bd_pins run_control_fsm_0/busy] [get_bd_pins runCtrlBusy] [get_bd_pins command_decoder_0/runCtrlBusy]
connect_bd_net [get_bd_pins run_control_fsm_0/fifoRst] [get_bd_pins fifoRst]
connect_bd_net [get_bd_pins run_control_fsm_0/fsmState] [get_bd_pins command_decoder_0/fsmState]
connect_bd_net [get_bd_pins run_control_fsm_0/reset_counters] [get_bd_pins reset_counters]
connect_bd_net [get_bd_pins run_control_fsm_0/running] \
  [get_bd_pins run] [get_bd_pins trgFlagBuilder_0/running] [get_bd_pins command_decoder_0/running]
connect_bd_net [get_bd_pins run_control_fsm_0/timeout] [get_bd_pins command_decoder_0/timeout]
connect_bd_net [get_bd_pins run_control_fsm_0/timeoutFlag] [get_bd_pins command_decoder_0/timeoutFlag]
connect_bd_net [get_bd_pins run_control_fsm_0/trigger_out] [get_bd_pins trigger_out] [get_bd_pins trgFlagBuilder_0/trg_out]
connect_bd_net [get_bd_pins selfTrigger_0/trgOut] [get_bd_pins run_control_fsm_0/selfTrgIn]
connect_bd_net -net synchronizers_0_busySync [get_bd_pins busy] [get_bd_pins command_decoder_0/busy] [get_bd_pins run_control_fsm_0/busy_in]
connect_bd_net -net synchronizers_0_extTrgSync [get_bd_pins trigger_ext] [get_bd_pins trgConcat/In1] [get_bd_pins run_control_fsm_0/trigger_ext]
connect_bd_net -net synchronizers_0_trgSync [get_bd_pins trigger_in] [get_bd_pins trgConcat/In0] [get_bd_pins run_control_fsm_0/trigger_in]
connect_bd_net [get_bd_pins trgConcat/dout] [get_bd_pins pulseExtender_0/sigIn]
connect_bd_net [get_bd_pins trgFlagBuilder_0/ready] [get_bd_pins ready]
connect_bd_net [get_bd_pins trgFlagBuilder_0/triggerFlags] [get_bd_pins triggerFlags]

current_bd_instance /counters
connect_bd_net [get_bd_pins GTUcounter_0/GTUcounted] [get_bd_pins GTUcounted]
connect_bd_net [get_bd_pins GTUcounter_0/ready] [get_bd_pins gtuCountReady]
connect_bd_net -net In1_1 [get_bd_pins extTrgIn] [get_bd_pins cL10L16extTclkbTToutGTUCLK40/In1]
connect_bd_net -net In4_1 [get_bd_pins clk40MTick] [get_bd_pins cL10L16extTclkbTToutGTUCLK40/In4]
connect_bd_net [get_bd_pins aliveDeadTCounter_0/aliveT] [get_bd_pins aliveT]
connect_bd_net [get_bd_pins aliveDeadTCounter_0/deadT] [get_bd_pins deadT]
connect_bd_net [get_bd_pins aliveDeadTCounter_0/ready] [get_bd_pins ready2]
connect_bd_net -net cL10L16clkbTextTToutGTUCLK40_dout [get_bd_pins cL10L16extTclkbTToutGTUCLK40/dout] [get_bd_pins rateMetersTrgGtuClk40M/sigIn]
connect_bd_net [get_bd_pins clk40M/Dout] [get_bd_pins rateClk40M]
connect_bd_net [get_bd_pins clkbTrg/Dout] [get_bd_pins rateClkbTrg]
connect_bd_net -net command_decoder_0_run [get_bd_pins run] [get_bd_pins GTUcounter_0/run] [get_bd_pins aliveDeadTCounter_0/running]
connect_bd_net [get_bd_pins counterRstCtrl_0/rstEvtOut] [get_bd_pins reg_event_number_0/clear]
connect_bd_net [get_bd_pins counterRstCtrl_0/rstGtuOut] [get_bd_pins GTUcounter_0/clear]
connect_bd_net [get_bd_pins counterRstCtrl_0/rstTrgOut] [get_bd_pins trgCounter_0/clr]
connect_bd_net [get_bd_pins dataReady] [get_bd_pins GTUcounter_0/dataReady]
connect_bd_net [get_bd_pins extTrg/Dout] [get_bd_pins rateExtTrg]
connect_bd_net -net gtuGenerator_0_gtuTick [get_bd_pins gtuTick] [get_bd_pins GTUcounter_0/gtuTick] [get_bd_pins cL10L16extTclkbTToutGTUCLK40/In3]
connect_bd_net [get_bd_pins gtu/Dout] [get_bd_pins rateGtu]
connect_bd_net -net ppsCtrl_0_ppsOut [get_bd_pins pps] [get_bd_pins GTUcounter_0/pps]
connect_bd_net -net processing_system7_0_FCLK_CLK0 [get_bd_pins clk] \
  [get_bd_pins reg_event_number_0/clock] [get_bd_pins GTUcounter_0/clk] [get_bd_pins aliveDeadTCounter_0/clk] \
  [get_bd_pins counterRstCtrl_0/clk] [get_bd_pins trgCounter_0/clk] [get_bd_pins rateMetersTrgGtuClk40M/clk]
connect_bd_net [get_bd_pins rateL10/Dout] [get_bd_pins rateL10]
connect_bd_net [get_bd_pins rateL11/Dout] [get_bd_pins rateL11]
connect_bd_net [get_bd_pins rateL12/Dout] [get_bd_pins rateL12]
connect_bd_net [get_bd_pins rateL13/Dout] [get_bd_pins rateL13]
connect_bd_net [get_bd_pins rateL14/Dout] [get_bd_pins rateL14]
connect_bd_net [get_bd_pins rateL15/Dout] [get_bd_pins rateL15]
connect_bd_net [get_bd_pins rateL16/Dout] [get_bd_pins rateL16]
connect_bd_net [get_bd_pins rateMetersTrgGtuClk40M/rateOut] \
  [get_bd_pins extTrg/Din] [get_bd_pins gtu/Din] [get_bd_pins rateL12/Din] [get_bd_pins rateL10/Din] \
  [get_bd_pins rateL16/Din] [get_bd_pins rateL14/Din] [get_bd_pins rateL11/Din] [get_bd_pins rateL13/Din] \
  [get_bd_pins rateL15/Din] [get_bd_pins clkbTrg/Din] [get_bd_pins trgOut/Din] [get_bd_pins clk40M/Din]
connect_bd_net [get_bd_pins reg_event_number_0/ready] [get_bd_pins evtNumberReady]
connect_bd_net [get_bd_pins reg_event_number_0/reg_out] [get_bd_pins evtNumberOut]
connect_bd_net [get_bd_pins rstAll] [get_bd_pins counterRstCtrl_0/rstAll]
connect_bd_net [get_bd_pins rstEvtN] [get_bd_pins counterRstCtrl_0/rstEvt]
connect_bd_net [get_bd_pins rstFromRun] [get_bd_pins counterRstCtrl_0/rstFromRun]
connect_bd_net [get_bd_pins rstGtu] [get_bd_pins counterRstCtrl_0/rstGtu]
connect_bd_net [get_bd_pins rstTrg] [get_bd_pins counterRstCtrl_0/rstTrg]
connect_bd_net -net rst_ps7_0_100M_peripheral_reset [get_bd_pins rst] \
  [get_bd_pins reg_event_number_0/reset] [get_bd_pins GTUcounter_0/rst] [get_bd_pins aliveDeadTCounter_0/rst] \
  [get_bd_pins counterRstCtrl_0/rst] [get_bd_pins trgCounter_0/rst] [get_bd_pins rateMetersTrgGtuClk40M/rst]
connect_bd_net -net run_control_fsm_0_busy [get_bd_pins busy] [get_bd_pins aliveDeadTCounter_0/busy]
connect_bd_net -net run_control_fsm_0_trigger_out [get_bd_pins trgIn] \
  [get_bd_pins reg_event_number_0/load] [get_bd_pins GTUcounter_0/trigger] [get_bd_pins aliveDeadTCounter_0/trgIn] \
  [get_bd_pins cL10L16extTclkbTToutGTUCLK40/In2]
connect_bd_net -net synchronizers_0_trgSync [get_bd_pins trgIn1] [get_bd_pins trgCounter_0/trgIn] [get_bd_pins cL10L16extTclkbTToutGTUCLK40/In0]
connect_bd_net [get_bd_pins trg0Cnt/Dout] [get_bd_pins trg0CntOut]
connect_bd_net [get_bd_pins trg1Cnt/Dout] [get_bd_pins trg1CntOut]
connect_bd_net [get_bd_pins trg2Cnt/Dout] [get_bd_pins trg2CntOut]
connect_bd_net [get_bd_pins trg3Cnt/Dout] [get_bd_pins trg3CntOut]
connect_bd_net [get_bd_pins trg4Cnt/Dout] [get_bd_pins trg4CntOut]
connect_bd_net [get_bd_pins trg5Cnt/Dout] [get_bd_pins trg5CntOut]
connect_bd_net [get_bd_pins trg6Cnt/Dout] [get_bd_pins trg6CntOut]
connect_bd_net [get_bd_pins trgCounter_0/trgCount] \
  [get_bd_pins trg0Cnt/Din] [get_bd_pins trg2Cnt/Din] [get_bd_pins trg3Cnt/Din] [get_bd_pins trg1Cnt/Din] \
  [get_bd_pins trg5Cnt/Din] [get_bd_pins trg6Cnt/Din] [get_bd_pins trg4Cnt/Din]
connect_bd_net [get_bd_pins trgOut/Dout] [get_bd_pins rateTrgOut]

current_bd_instance /outBuffers
connect_bd_net -net In3_1 [get_bd_pins L1Out] [get_bd_pins pulseExtender_0/sigIn]
connect_bd_net [get_bd_pins gtuClock] \
  [get_bd_pins gtuClockConcat/In1] [get_bd_pins gtuClockConcat/In2] [get_bd_pins gtuClockConcat/In3] \
  [get_bd_pins gtuClockConcat/In0] [get_bd_pins gtuClockConcat/In4] [get_bd_pins gtuClockConcat/In5] \
  [get_bd_pins gtuClockConcat/In6]
connect_bd_net -net OBUF_IN_1 [get_bd_pins runCtrlBusy] [get_bd_pins busy_OBUFDS/OBUF_IN]
connect_bd_net -net OBUF_IN_2 [get_bd_pins acqStatusOut] \
  [get_bd_pins acqStatusOutConcat/In0] [get_bd_pins acqStatusOutConcat/In3] [get_bd_pins acqStatusOutConcat/In2] \
  [get_bd_pins acqStatusOutConcat/In1] [get_bd_pins acqStatusOutConcat/In4] [get_bd_pins acqStatusOutConcat/In5] \
  [get_bd_pins acqStatusOutConcat/In6]
connect_bd_net [get_bd_pins busy_OBUFDS/OBUF_DS_N] [get_bd_pins BUSY_OUT_N]
connect_bd_net [get_bd_pins busy_OBUFDS/OBUF_DS_P] [get_bd_pins BUSY_OUT_P]
connect_bd_net [get_bd_pins clk40NConcat/dout] [get_bd_pins CLK40_OUT_N]
connect_bd_net -net clk40Out_BUFGCE_BUFGCE_O [get_bd_pins clk40M] \
  [get_bd_pins clk40Out_OBUFDS0/OBUF_IN] [get_bd_pins clk40Out_OBUFDS1/OBUF_IN] [get_bd_pins clk40Out_OBUFDS2/OBUF_IN] \
  [get_bd_pins clk40Out_OBUFDS3/OBUF_IN] [get_bd_pins clk40Out_OBUFDS4/OBUF_IN] [get_bd_pins clk40Out_OBUFDS5/OBUF_IN] \
  [get_bd_pins clk40Out_OBUFDS6/OBUF_IN]
connect_bd_net [get_bd_pins clk40Out_OBUFDS0/OBUF_DS_N] [get_bd_pins clk40NConcat/In0]
connect_bd_net [get_bd_pins clk40Out_OBUFDS0/OBUF_DS_P] [get_bd_pins clk40PConcat/In0]
connect_bd_net [get_bd_pins clk40Out_OBUFDS1/OBUF_DS_N] [get_bd_pins clk40NConcat/In1]
connect_bd_net [get_bd_pins clk40Out_OBUFDS1/OBUF_DS_P] [get_bd_pins clk40PConcat/In1]
connect_bd_net [get_bd_pins clk40Out_OBUFDS2/OBUF_DS_N] [get_bd_pins clk40NConcat/In2]
connect_bd_net [get_bd_pins clk40Out_OBUFDS2/OBUF_DS_P] [get_bd_pins clk40PConcat/In2]
connect_bd_net [get_bd_pins clk40Out_OBUFDS3/OBUF_DS_N] [get_bd_pins clk40NConcat/In3]
connect_bd_net [get_bd_pins clk40Out_OBUFDS3/OBUF_DS_P] [get_bd_pins clk40PConcat/In3]
connect_bd_net [get_bd_pins clk40Out_OBUFDS4/OBUF_DS_N] [get_bd_pins clk40NConcat/In4]
connect_bd_net [get_bd_pins clk40Out_OBUFDS4/OBUF_DS_P] [get_bd_pins clk40PConcat/In4]
connect_bd_net [get_bd_pins clk40Out_OBUFDS5/OBUF_DS_N] [get_bd_pins clk40NConcat/In5]
connect_bd_net [get_bd_pins clk40Out_OBUFDS5/OBUF_DS_P] [get_bd_pins clk40PConcat/In5]
connect_bd_net [get_bd_pins clk40Out_OBUFDS6/OBUF_DS_N] [get_bd_pins clk40NConcat/In6]
connect_bd_net [get_bd_pins clk40Out_OBUFDS6/OBUF_DS_P] [get_bd_pins clk40PConcat/In6]
connect_bd_net [get_bd_pins clk40PConcat/dout] [get_bd_pins CLK40_OUT_P]
connect_bd_net [get_bd_pins clk] [get_bd_pins pulseExtender_0/clk]
connect_bd_net [get_bd_pins extTrg_OBUFDS/OBUF_DS_N] [get_bd_pins EXT_TRIG_OUT_N]
connect_bd_net [get_bd_pins extTrg_OBUFDS/OBUF_DS_P] [get_bd_pins EXT_TRIG_OUT_P]
connect_bd_net [get_bd_pins gtuClock_OBUFDS/OBUF_DS_N] [get_bd_pins GTU_CLK_OUT_N]
connect_bd_net [get_bd_pins gtuClock_OBUFDS/OBUF_DS_P] [get_bd_pins GTU_CLK_OUT_P]
connect_bd_net -net ilconcat_0_dout [get_bd_pins acqStatusOutConcat/dout] [get_bd_pins util_ds_buf_0/OBUF_IN]
connect_bd_net -net ilconcat_0_dout1 [get_bd_pins extTrgOutConcat/dout] [get_bd_pins extTrg_OBUFDS/OBUF_IN]
connect_bd_net -net ilconcat_0_dout3 [get_bd_pins ppsOutConcat/dout] [get_bd_pins ppsOut_OBUFDS/OBUF_IN]
connect_bd_net -net ilconcat_1_dout [get_bd_pins gtuClockConcat/dout] [get_bd_pins gtuClock_OBUFDS/OBUF_IN]
connect_bd_net -net ilconstant_0_dout1 [get_bd_pins gpsEnConst/dout] [get_bd_pins GPS_EN]
connect_bd_net -net l1TrigOut_OBUF_DS_N [get_bd_pins l1TrigOut_OBUFDS/OBUF_DS_N] [get_bd_pins TRIG_L1_OUT_N]
connect_bd_net -net l1TrigOut_OBUF_DS_P [get_bd_pins l1TrigOut_OBUFDS/OBUF_DS_P] [get_bd_pins TRIG_L1_OUT_P]
connect_bd_net -net ppsCtrl_0_ppsOut [get_bd_pins ppsOut] \
  [get_bd_pins ppsOutConcat/In2] [get_bd_pins ppsOutConcat/In1] [get_bd_pins ppsOutConcat/In3] [get_bd_pins ppsOutConcat/In0] \
  [get_bd_pins ppsOutConcat/In4] [get_bd_pins ppsOutConcat/In5] [get_bd_pins ppsOutConcat/In6]
connect_bd_net [get_bd_pins ppsOut_OBUFDS/OBUF_DS_N] [get_bd_pins PPS_OUT_N]
connect_bd_net [get_bd_pins ppsOut_OBUFDS/OBUF_DS_P] [get_bd_pins PPS_OUT_P]
connect_bd_net [get_bd_pins pulseExtender_0/sigOut] \
  [get_bd_pins extTrgOutConcat/In0] [get_bd_pins extTrgOutConcat/In1] [get_bd_pins extTrgOutConcat/In2] \
  [get_bd_pins extTrgOutConcat/In3] [get_bd_pins l1TrigOut_OBUFDS/OBUF_IN] [get_bd_pins extTrgOutConcat/In4] \
  [get_bd_pins extTrgOutConcat/In5] [get_bd_pins extTrgOutConcat/In6]
connect_bd_net [get_bd_pins rst] [get_bd_pins pulseExtender_0/rst]
connect_bd_net [get_bd_pins util_ds_buf_0/OBUF_DS_N] [get_bd_pins ACQ_STATUS_OUT_N]
connect_bd_net [get_bd_pins util_ds_buf_0/OBUF_DS_P] [get_bd_pins ACQ_STATUS_OUT_P]
